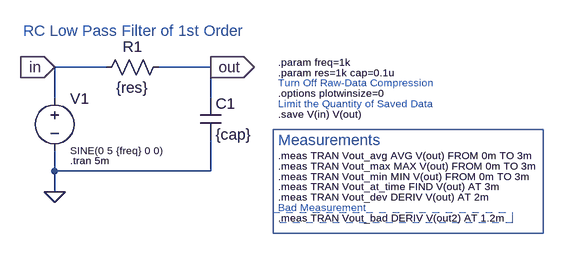
[diagram p0: schematic LowPassFilter_Meas.asc]
LowPassFilter_Meas.asc, the LTspice schematic file:
Version 4
SHEET 1 956 680
WIRE 128 80 48 80
WIRE 288 80 208 80
WIRE 48 128 48 80
WIRE 288 128 288 80
WIRE 48 240 48 208
WIRE 288 240 288 192
WIRE 288 240 48 240
WIRE 48 272 48 240
FLAG 48 272 0
FLAG 48 80 in
IOPIN 48 80 In
FLAG 288 80 out
IOPIN 288 80 Out
SYMBOL voltage 48 112 R0
WINDOW 3 24 96 Left 1
WINDOW 123 0 0 Left 0
WINDOW 39 0 0 Left 0
SYMATTR Value SINE(0 5 {freq} 0 0)
SYMATTR InstName V1
SYMBOL res 224 64 R90
WINDOW 0 0 56 VBottom 2
WINDOW 3 32 56 VTop 2
SYMATTR InstName R1
SYMATTR Value {res}
SYMBOL cap 272 128 R0
SYMATTR InstName C1
SYMATTR Value {cap}
TEXT 72 224 Left 1 !.tran 5m
TEXT 392 72 Left 1 !.param freq=1k
TEXT 392 88 Left 1 !.param res=1k cap=0.1u
TEXT 392 120 Left 1 !.options plotwinsize=0
TEXT 392 152 Left 1 !.save V(in) V(out)
TEXT 392 104 Left 1 ;Turn Off Raw-Data Compression
TEXT 392 136 Left 1 ;Limit the Quantity of Saved Data
TEXT 0 24 Left 2 ;RC Low Pass Filter of 1st Order
TEXT 392 216 Left 1 !.meas TRAN Vout_avg AVG V(out) FROM 0m TO 3m
TEXT 392 192 Left 2 ;Measurements
TEXT 392 232 Left 1 !.meas TRAN Vout_max MAX V(out) FROM 0m TO 3m
TEXT 392 248 Left 1 !.meas TRAN Vout_min MIN V(out) FROM 0m TO 3m
TEXT 392 264 Left 1 !.meas TRAN Vout_at_time FIND V(out) AT 3m
TEXT 392 280 Left 1 !.meas TRAN Vout_dev DERIV V(out) AT 2m
TEXT 392 312 Left 1 !.meas TRAN Vout_bad DERIV V(out2) AT 1.2m
TEXT 392 296 Left 1 ;Bad Measurement
RECTANGLE Normal 800 336 384 176
RECTANGLE Normal 752 320 384 304 2

The netlist it stands for:
* LowPassFilter_Meas.asc
V1 in 0 SINE(0 5 {freq} 0 0)
R1 out in {res}
C1 out 0 {cap}
.tran 5m
.param freq=1k
.param res=1k cap=0.1u
.options plotwinsize=0
.save V(in) V(out)
* Turn Off Raw-Data Compression
* Limit the Quantity of Saved Data
* RC Low Pass Filter of 1st Order
.meas TRAN Vout_avg AVG V(out) FROM 0m TO 3m
* Measurements
.meas TRAN Vout_max MAX V(out) FROM 0m TO 3m
.meas TRAN Vout_min MIN V(out) FROM 0m TO 3m
.meas TRAN Vout_at_time FIND V(out) AT 3m
.meas TRAN Vout_dev DERIV V(out) AT 2m
.meas TRAN Vout_bad DERIV V(out2) AT 1.2m
* Bad Measurement
.backanno
.end

* Results of the author's LTspice run, read from the files saved beside the schematic
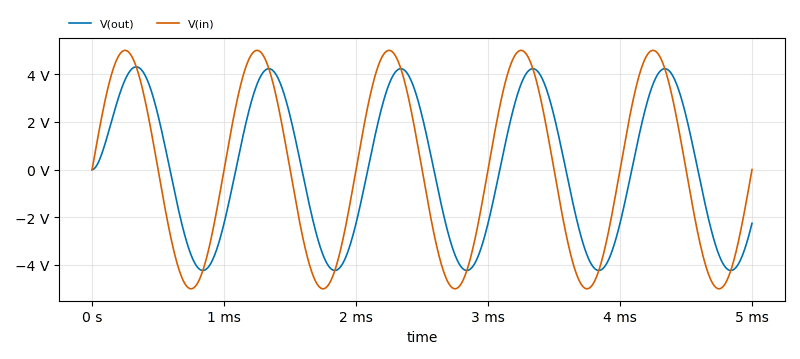
[diagram p1: Transient Analysis of LowPassFilter_Meas.asc, plotted from the saved traces]
* Transient Analysis, 1 run:
*   V(out): min -4.233 V, max 4.31 V, average 45.07 mV, rms 3.001 V, last -2.252 V
*   V(in): min -5 V, max 5 V, average 0 V, rms 3.536 V, last 0 V
* From the log:
*   vout_avg: AVG(v(out))=0.0751235 FROM 0 TO 0.003
*   vout_max: MAX(v(out))=4.31 FROM 0 TO 0.003
*   vout_min: MIN(v(out))=-4.23251 FROM 0 TO 0.003
*   vout_at_time: v(out)=-2.25185 at 0.003
*   vout_dev: D(v(out))=22607.7 at 0.002
*   Measurement "vout_bad" FAIL'ed